# Altium schematic sheet Gastroscopy-Tool-Sensor_LED.SchDoc: LED Driver
size 279 x 215 mm; Date: not used; ApprovedBy: not used; CheckedBy: not used; Author: not used; DrawnBy: not used; Organization: not used; Address4: not used; SheetNumber: 5; SheetTotal: 5; Time: not used; ImagePath: not used; Application_BuildNumber: not used
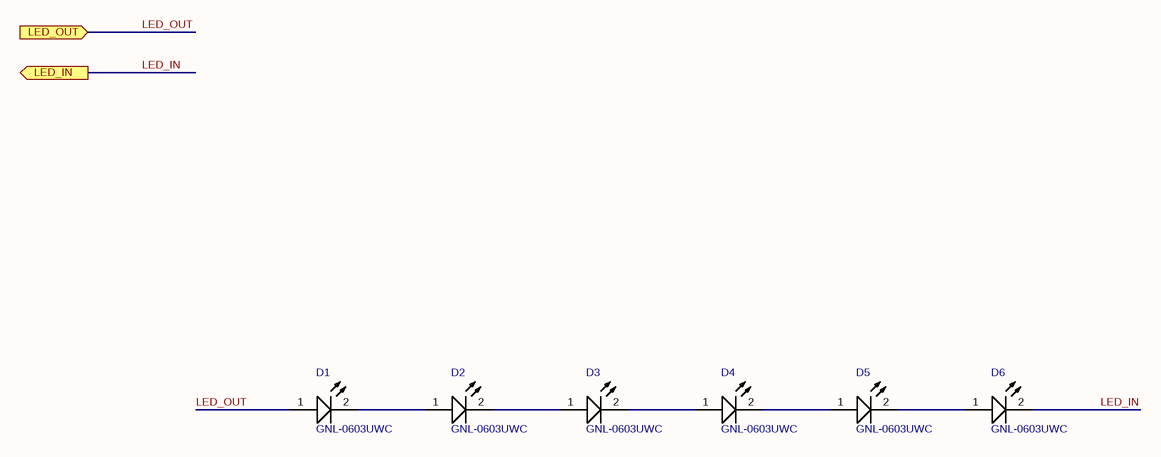
[diagram p0: Gastroscopy-Tool-Sensor_LED.SchDoc]

## Parts
D1  GNL-0603UWC  [L_0603_WHITE]
D2  GNL-0603UWC  [L_0603_WHITE]
D3  GNL-0603UWC  [L_0603_WHITE]
D4  GNL-0603UWC  [L_0603_WHITE]
D5  GNL-0603UWC  [L_0603_WHITE]
D6  GNL-0603UWC  [L_0603_WHITE]

## Ports
LED_IN (out), LED_OUT (in)

## Nets
LED_IN: D6.2(K) ; port LED_IN
LED_OUT: D1.1(A) ; port LED_OUT
NetD1_2: D1.2(K) D2.1(A)
NetD2_2: D2.2(K) D3.1(A)
NetD3_2: D3.2(K) D4.1(A)
NetD4_2: D4.2(K) D5.1(A)
NetD5_2: D5.2(K) D6.1(A)

## Notes on the sheet
- Title:
- Date:
- Size A
- Project:
- Number:
- Time:
- Sheet
- Revision
- of
- Engineer:
- www.mrobots.ru <http://mrobots.ru/>
- File:

## Library data of the parts
D1-D6 = GNL-0603UWC: LED WHITE CLEAR SMD; Manufacturer 1: G-nor Electronics; Manufacturer Part Number 1: GNL-0603UWC